# EAGLE design SparkFun_VR_IMU_Breakout_BNO086_QWIIC (EAGLE 9.6.2)
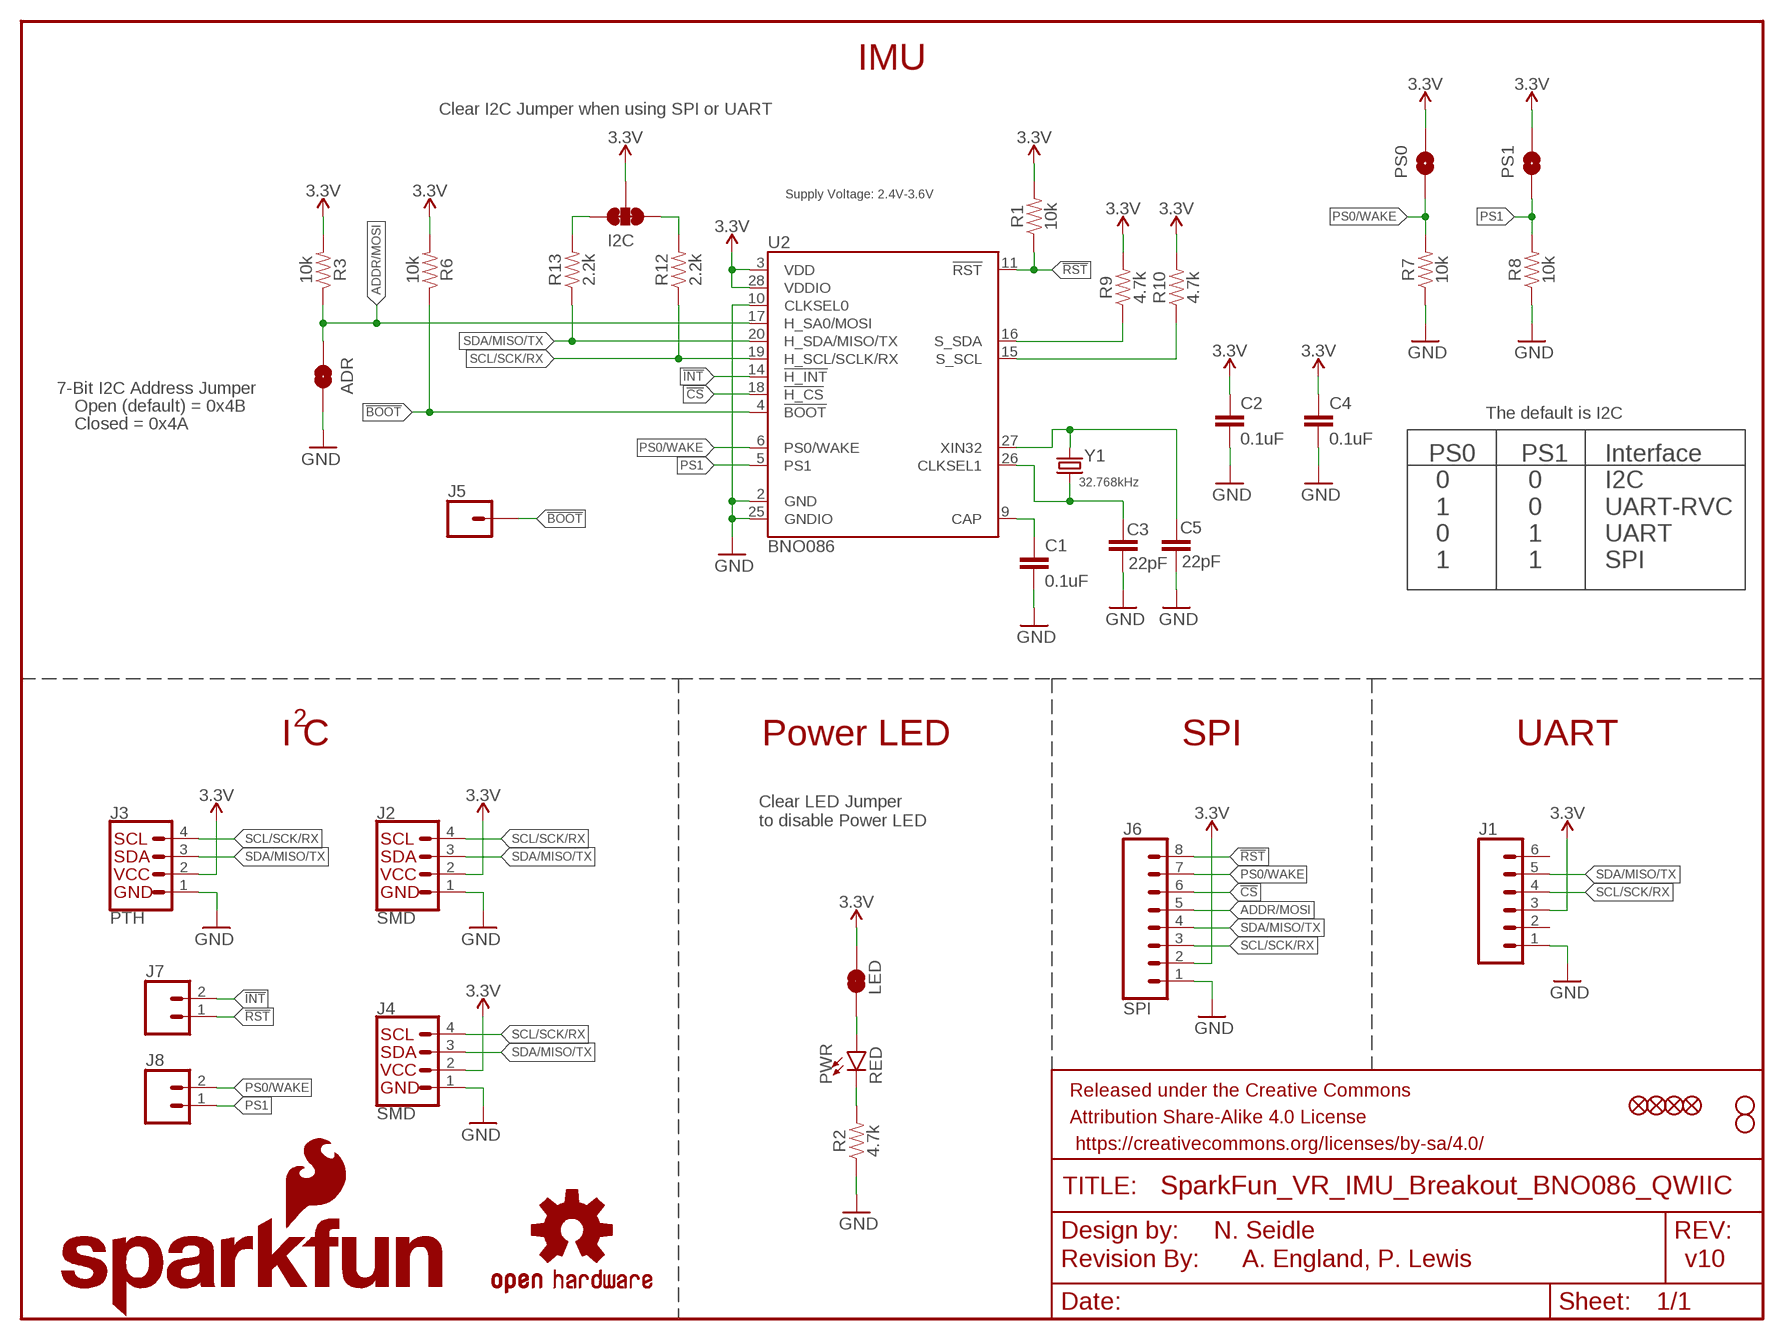
[diagram p0: schematic, sheet 1]

## Parts
ADR  JUMPER-SMT_2_NO_SILK  [SMT-JUMPER_2_NO_SILK]
C1  0.1uF  0.1UF-0603-25V-(+80/-20%)  [0603]
C2  0.1uF  0.1UF-0603-25V-(+80/-20%)  [0603]
C3  22pF  22PF-0603-50V-5%  [0603]
C4  0.1uF  0.1UF-0603-25V-(+80/-20%)  [0603]
C5  22pF  22PF-0603-50V-5%  [0603]
FRAME1  FRAME-LETTER  [CREATIVE_COMMONS]
I2C  JUMPER-SMT_3_2-NC_TRACE_SILK  [SMT-JUMPER_3_2-NC_TRACE_SILK]
J1  CONN_06NO_SILK_FEMALE_PTH  [1X06_NO_SILK]
J2  SMD  QWIIC_CONNECTORJS-1MM  [JST04_1MM_RA]
J3  PTH  I2C_STANDARD_NO_SILK  [1X04_NO_SILK]
J4  SMD  QWIIC_CONNECTORJS-1MM  [JST04_1MM_RA]
J5  CONN_01PTH_NO_SILK_YES_STOP  [1X01_NO_SILK]
J6  SPI  CONN_08NO_SILK_FEMALE_PTH  [1X08_NO_SILK]
J7  CONN_021X02_NO_SILK  [1X02_NO_SILK]
J8  CONN_021X02_NO_SILK  [1X02_NO_SILK]
JP1  FIDUCIALUFIDUCIAL  [FIDUCIAL-MICRO]
JP2  FIDUCIALUFIDUCIAL  [FIDUCIAL-MICRO]
JP3  STAND-OFF  [STAND-OFF]
JP4  STAND-OFF  [STAND-OFF]
JP5  FIDUCIALUFIDUCIAL  [FIDUCIAL-MICRO]
JP6  FIDUCIALUFIDUCIAL  [FIDUCIAL-MICRO]
LED  JUMPER-SMT_2_NC_TRACE_SILK  [SMT-JUMPER_2_NC_TRACE_SILK]
LOGO1  OSHW-LOGOMINI  [OSHW-LOGO-MINI]
LOGO2  REVISION  [REVISION]
LOGO4  SFE_LOGO_FLAME.2_INCH  [SFE_LOGO_FLAME_.2]
LOGO5  SFE_LOGO_NAME_FLAME.1_INCH  [SFE_LOGO_NAME_FLAME_.1]
PS0  JUMPER-SMT_2_NO_SILK  [SMT-JUMPER_2_NO_SILK]
PS1  JUMPER-SMT_2_NO_SILK  [SMT-JUMPER_2_NO_SILK]
PWR  RED  LED-RED_0603-KB  [LED-0603]
R1  10k  10KOHM-0603-1/10W-1%  [0603]
R2  4.7k  4.7KOHM-0603-1/10W-1%  [0603]
R3  10k  10KOHM-0603-1/10W-1%  [0603]
R6  10k  10KOHM-0603-1/10W-1%  [0603]
R7  10k  10KOHM-0603-1/10W-1%  [0603]
R8  10k  10KOHM-0603-1/10W-1%  [0603]
R9  4.7k  4.7KOHM-0603-1/10W-1%  [0603]
R10  4.7k  4.7KOHM-0603-1/10W-1%  [0603]
R12  2.2k  2.2KOHM-0603-1/10W-1%  [0603]
R13  2.2k  2.2KOHM-0603-1/10W-1%  [0603]
U2  BNO086  [LGA-28]
Y1  32.768kHz  CRYSTAL-32.768KHZSMD-3.2X1.5  [CRYSTAL-SMD-3.2X1.5MM]

## Nets
3.3V: C2.1 C4.1 I2C.2 J1.3 J2.2 J3.2 J4.2 J6.2 LED.1 PS0.1 PS1.1 R1.2 R3.2 R6.2 R9.2 R10.2 U2.3(VDD) U2.28(VDDIO)
!BOOT: J5.1 R6.1 U2.4(!BOOT)
!CS: J6.6 U2.18(!H_CS)
!INT: J7.2 U2.14(!H_INT)
!RST: J6.8 J7.1 R1.1 U2.11(!RST)
ADDR/MOSI: ADR.2 J6.5 R3.1 U2.17(H_SA0/MOSI)
CAP: C1.1 U2.9(CAP)
GND: ADR.1 C1.2 C2.2 C3.2 C4.2 C5.2 J1.1 J2.1 J3.1 J4.1 J6.1 R2.1 R7.1 R8.1 U2.2(GND) U2.10(CLKSEL0) U2.25(GNDIO)
N$1: C5.1 U2.27(XIN32) Y1.P$2
N$2: C3.1 U2.26(CLKSEL1) Y1.P$1
N$3: PWR.C R2.2
N$4: LED.2 PWR.A
PS0/WAKE: J6.7 J8.2 PS0.2 R7.2 U2.6(PS0/WAKE)
PS1: J8.1 PS1.2 R8.2 U2.5(PS1)
S_SCL: R10.1 U2.15(S_SCL)
S_SDA: R9.1 U2.16(S_SDA)
SCL/SCK/RX: J1.4 J2.4 J3.4 J4.4 J6.3 R12.1 U2.19(H_SCL/SCLK/RX)
SCL_PU: I2C.1 R12.2
SDA/MISO/TX: J1.5 J2.3 J3.3 J4.3 J6.4 R13.1 U2.20(H_SDA/MISO/TX)
SDA_PU: I2C.3 R13.2
Unconnected: J1.2 J1.6

## Notes on the sheet
- IMU
- Clear I2C Jumper when using SPI or UART
- Supply Voltage: 2.4V-3.6V
- 7-Bit I2C Address Jumper
- Open (default) = 0x4B
- The default is I2C
- Closed = 0x4A
- PS0
   0
   1
   0
   1
- PS1
   0
   0
   1
   1
- Interface
  I2C
  UART-RVC
  UART
  SPI
- 2
- I C | Power LED | SPI | UART
- Clear LED Jumper 
  to disable Power LED
- N. Seidle
- A. England, P. Lewis | v10

## Library data of the parts
ADR PS0 PS1 = SparkFun-Jumpers:JUMPER-SMT_2_NO: Normally open jumper This jumper has two pads in close proximity to each other. Apply solder to close the connection. Round pads are easier to solder for beginners, but are a lot larger. SparkFun Product that uses the round pads: SparkFun EL Sequencer <https://www.sparkfun.com/products/12781>
C1 C2 C4 = SparkFun-Capacitors:0.1UF: 0.1µF ceramic capacitors A capacitor is a passive two-terminal electrical component used to store electrical energy temporarily in an electric field.; PROD_ID: CAP-00810
C3 C5 = SparkFun-Capacitors:22PF: 22pF ceramic capacitors A capacitor is a passive two-terminal electrical component used to store electrical energy temporarily in an electric field.; PROD_ID: CAP-07876
FRAME1 = SparkFun-Aesthetics:FRAME-LETTER: Schematic Frame - Letter Standard 8.5x11 US Letter frame
I2C = SparkFun-Jumpers:JUMPER-SMT_3_2-NC_TRACE: Normally closed trace jumper (2 of 2 connections) This jumper has a trace between all three pads so they are normally closed (NC). Use a razor knife to open the connection(s). For best results follow the IPC guidelines for cutting traces: Cutout at least 0.063 mm (0.005 in). Remove all loose material to clean up the cut area. Seal the cut with an approved epoxy. Reapply solder to reclose the connection(s).
J1 = SparkFun-Connectors:CONN_06: Multi connection point. Often used as Generic Header-pin footprint for 0.1 inch spaced/style header connections On any of the 0.1 inch spaced packages, you can populate with these: Break Away Headers - Straight <https://www.sparkfun.com/products/116> (PRT-00116) Break Away Male Headers - Right Angle <https://www.sparkfun.com/products/553> (PRT-00553) Female Headers <https://www.sparkfun.com/products/115> (PRT-00115) Break Away Headers - Machine Pin <https://www.sparkfun.com/products/117> (PRT-00117) Break Away Female Headers - Swiss Machine Pin <https://www.sparkfun.com/products/743> (PRT-00743) Arduino Stackable Header - 6 Pin <https://www.sparkfun.com/products/9280> (PRT-09280) Screw Terminals 2.54mm Pitch (6-Pin) <https://www.sparkfun.com/products/16499> (PRT-16499) For SCREWTERMINALS and SPRING TERMINALS visit here: Screw Terimnals on SparkFun.com <https://www.sparkfun.com/search/results?term=Screw+Terminals> (5mm/3.5mm/2.54mm spacing) This device is also useful as a general connection point to wire up your design to another part of your project. Our various solder wires solder well into these plated through hole pads. Hook-Up Wire - Assortment (Stranded, 22 AWG) <https://www.sparkfun.com/products/11375> (PRT-11375) Hook-Up Wire - Assortment (Solid Core, 22 AWG) <https://www.sparkfun.com/products/11367> (PRT-11367) View the entire wire category on our website here <https://www.sparkfun.com/categories/141>; PROD_ID: CONN-08437
J2 J4 = SparkFun-Connectors:QWIIC_CONNECTOR: SparkFun I2C Standard Qwiic Connector An SMD 1mm pitch JST connector makes it easy and quick (get it? Qwiic?) to connect I2C devices to each other. The Qwiic system <http://www.sparkfun.com/qwiic> enables fast and solderless connection between popular platforms and various sensors and actuators. We carry 200mm <https://www.sparkfun.com/products/14204>, 100mm <https://www.sparkfun.com/products/14205>, 50mm <https://www.sparkfun.com/products/14206>, and breadboard friendly <https://www.sparkfun.com/products/14207> Qwiic cables. We also offer 10 pcs strips <https://www.sparkfun.com/products/14323> the SMD connectors.; PROD_ID: CONN-13694; VALUE: QWIIC_RIGHT_ANGLE
J3 = SparkFun-Connectors:I2C_STANDARD: SparkFun I2C Standard Pinout Header SparkFun has standardized on a pinout for all I2C based sensor breakouts. This pinout allows I2C boards to be plugged directly into the headers on Arduino Uno compatible boards, and to be daisy chained easily. Example SparkFun Products: SparkFun Atmospheric Sensor Breakout - BME280 <https://www.sparkfun.com/products/13676> SparkFun Altitude/Pressure Sensor Breakout - MPL3115A2 <https://www.sparkfun.com/products/11084> SparkFun TOF Range Finder Sensor - VL6180 <https://www.sparkfun.com/products/12785>
J5 = SparkFun-Connectors:CONN_01: Single connection point. Often used as Generic Header-pin footprint for 0.1 inch spaced/style header connections On any of the 0.1 inch spaced packages, you can populate with these: Break Away Headers - Straight <https://www.sparkfun.com/products/116> (PRT-00116) Break Away Male Headers - Right Angle <https://www.sparkfun.com/products/553> (PRT-00553) Female Headers <https://www.sparkfun.com/products/115> (PRT-00115) Break Away Headers - Machine Pin <https://www.sparkfun.com/products/117> (PRT-00117) Break Away Female Headers - Swiss Machine Pin <https://www.sparkfun.com/products/743> (PRT-00743) This device is also useful as a general connection point to wire up your design to another part of your project. Our various solder wires solder well into these plated through hole pads. Hook-Up Wire - Assortment (Stranded, 22 AWG) <https://www.sparkfun.com/products/11375> (PRT-11375) Hook-Up Wire - Assortment (Solid Core, 22 AWG) <https://www.sparkfun.com/products/11367> (PRT-11367) View the entire wire category on our website here <https://www.sparkfun.com/categories/141> Special notes: SMTSO-256-ET is a "flush mount" nut for a 4-40 screw. We mostly use this on specialty testbeds; it is a nice way to connect hardware to your PCB at an adjustable hieght. Also note, the SNAP packages are for using a snappable style connector. We sell a baggie of snaps and they are also used on two LilyPad designs: Snap Assortment - 30 pack (male and female) <https://www.sparkfun.com/products/11347> (DEV-11347) LilyPad Arduino SimpleSnap <https://www.sparkfun.com/products/10941> (DEV-10941) LilyPad SimpleSnap Protoboard <https://www.sparkfun.com/products/10940> (DEV-10940)
J6 = SparkFun-Connectors:CONN_08: Multi connection point. Often used as Generic Header-pin footprint for 0.1 inch spaced/style header connections On any of the 0.1 inch spaced packages, you can populate with these: Break Away Headers - Straight <https://www.sparkfun.com/products/116> (PRT-00116) Break Away Male Headers - Right Angle <https://www.sparkfun.com/products/553> (PRT-00553) Female Headers <https://www.sparkfun.com/products/115> (PRT-00115) Break Away Headers - Machine Pin <https://www.sparkfun.com/products/117> (PRT-00117) Break Away Female Headers - Swiss Machine Pin <https://www.sparkfun.com/products/743> (PRT-00743) Arduino Stackable Header - 8 Pin <https://www.sparkfun.com/products/9279> (PRT-09279) For SCREWTERMINALS and SPRING TERMINALS visit here: Screw Terimnals on SparkFun.com <https://www.sparkfun.com/search/results?term=Screw+Terminals> (5mm/3.5mm/2.54mm spacing) This device is also useful as a general connection point to wire up your design to another part of your project. Our various solder wires solder well into these plated through hole pads. Hook-Up Wire - Assortment (Stranded, 22 AWG) <https://www.sparkfun.com/products/11375> (PRT-11375) Hook-Up Wire - Assortment (Solid Core, 22 AWG) <https://www.sparkfun.com/products/11367> (PRT-11367) View the entire wire category on our website here <https://www.sparkfun.com/categories/141> Special notes: Molex polarized connector foot print use with SKU : PRT-08231 with associated crimp pins and housings. 1MM SMD Version SKU: PRT-10208 NOTES ON THE VARIANTS LOCK and LOCK_LONGPADS... This footprint was designed to help hold the alignment of a through-hole component (i.e. 6-pin header) while soldering it into place. You may notice that each hole has been shifted either up or down by 0.005 of an inch from it's more standard position (which is a perfectly straight line). This slight alteration caused the pins (the squares in the middle) to touch the edges of the holes. Because they are alternating, it causes a "brace" to hold the component in place. 0.005 has proven to be the perfect amount of "off-center" position when using our standard breakaway headers. Although looks a little odd when you look at the bare footprint, once you have a header in there, the alteration is very hard to notice. Also,if you push a header all the way into place, it is covered up entirely on the bottom side.; PROD_ID: CONN-08438
J7 J8 = SparkFun-Connectors:CONN_02: Multi connection point. Often used as Generic Header-pin footprint for 0.1 inch spaced/style header connections On any of the 0.1 inch spaced packages, you can populate with these: Break Away Headers - Straight <https://www.sparkfun.com/products/116> (PRT-00116) Break Away Male Headers - Right Angle <https://www.sparkfun.com/products/553> (PRT-00553) Female Headers <https://www.sparkfun.com/products/115> (PRT-00115) Break Away Headers - Machine Pin <https://www.sparkfun.com/products/117> (PRT-00117) Break Away Female Headers - Swiss Machine Pin <https://www.sparkfun.com/products/743> (PRT-00743) For SCREWTERMINALS and SPRING TERMINALS visit here: Screw Terimnals on SparkFun.com <https://www.sparkfun.com/search/results?term=Screw+Terminals> (5mm/3.5mm/2.54mm spacing) This device is also useful as a general connection point to wire up your design to another part of your project. Our various solder wires solder well into these plated through hole pads. Hook-Up Wire - Assortment (Stranded, 22 AWG) <https://www.sparkfun.com/products/11375> (PRT-11375) Hook-Up Wire - Assortment (Solid Core, 22 AWG) <https://www.sparkfun.com/products/11367> (PRT-11367) View the entire wire category on our website here <https://www.sparkfun.com/categories/141> Special notes: Molex polarized connector foot print use with: PRT-08233 with associated crimp pins and housings. 2.54_SCREWTERM for use with PRT-10571. 3.5mm Screw Terminal footprints for PRT-08084 5mm Screw Terminal footprints for use with PRT-08432
JP1 JP2 JP5 JP6 = SparkFun-Aesthetics:FIDUCIAL: Fiducial Alignment Points Point-of-reference for pick-and-place machines and other optical instruments.
JP3 JP4 = SparkFun-Hardware:STAND-OFF: Stand Off Drill holes for mechanically mounting via screws, standoffs, etc. Note: Use the keepout ring to avoid running the screw head into surrounding components. Variant Overviews STAND-OFF - Mechanical footprint for a #4 phillips button head screw. STAND-OFF-TIGHT - Mechanical footprint for a #4 phillips button head screw, Example SparkFun Products Screw - Phillips Head (1/4", 4-40, 10 pack) <https://www.sparkfun.com/products/10453> (PRT-10453) Screw - Phillips Head (1/2", 4-40, 10 pack) <https://www.sparkfun.com/products/10452> (PRT-10452) Screw - Phillips Head (3/4", 4-40, 10 pack) <https://www.sparkfun.com/products/10451> (PRT-10451) Screw - Phillips Head (1", 4-40, 10 pack) <https://www.sparkfun.com/products/10450> (PRT-10450)
LED = SparkFun-Jumpers:JUMPER-SMT_2_NC_TRACE: Normally closed trace jumper This jumper has a trace between two pads so it's normally closed (NC). Use a razor knife to open the connection. For best results follow the IPC guidelines for cutting traces: Cutout at least 0.063 mm (0.005 in). Remove all loose material to clean up the cut area. Seal the cut with an approved epoxy. Reapply solder to reclose the connection.
LOGO1 = SparkFun-Aesthetics:OSHW-LOGO: Open-Source Hardware (OSHW) Logo This logo indicates the piece of hardware it is found on incorporates a OSHW license and/or adheres to the definition of open source hardware found here: http://freedomdefined.org/OSHW
LOGO2 = SparkFun-Aesthetics:REVISION: "Revision By" Text Preceding text for revisor documentation. Includes schematic text on "symbols" layer, and board text on tDoc.
LOGO4 = SparkFun-Aesthetics:SFE_LOGO_FLAME: SparkFun Flame Logo This is the SparkFun flame logo. The logo on the schematic will always be the same size; the package variant is the height of the flame. Default layer for the logo on the board is tSilk.
LOGO5 = SparkFun-Aesthetics:SFE_LOGO_NAME_FLAME: SparkFun Font Logo w/ Flame This is the SparkFun full logo. The logo on the schematic will always be the same size; the package variant is the height of the flame part of the logo. Default layer for the logo on the board is tSilk.
PWR = SparkFun-LED:LED-RED: Red SMD LED Used in manufacturing of most products at SparkFun Packages: 0603 - KB - KingBright (DIO-17976) SMD 0603 package [Datasheet] <https://www.kingbrightusa.com/images/catalog/SPEC/APT1608SURCK.pdf> 0603 - (DIO-00819, has gone EOL) SMD 0603 package 0603 SMART - SMD 0603 SMART package ( more efficient and expensive)[Product Link] <http://www.osram-os.com/Graphics/XPic2/00077099_0.pdf> 1206 - SMD1206 package [Product Link] <https://www.sparkfun.com/datasheets/DevTools/LilyPad/Q150OVS4.pdff> SparkFun Products: Pro Mini 328 -5V <https://www.sparkfun.com/products/821> RedBoard <https://www.sparkfun.com/products/12757> IOIO-OTG <https://www.sparkfun.com/products/13613>; PROD_ID: DIO-17976
R1 R3 R6-R8 = SparkFun-Resistors:10KOHM: 10kΩ resistor A resistor is a passive two-terminal electrical component that implements electrical resistance as a circuit element. Resistors act to reduce current flow, and, at the same time, act to lower voltage levels within circuits. - Wikipedia; PROD_ID: RES-00824
R2 R9 R10 = SparkFun-Resistors:4.7KOHM: 4.7kΩ resistor A resistor is a passive two-terminal electrical component that implements electrical resistance as a circuit element. Resistors act to reduce current flow, and, at the same time, act to lower voltage levels within circuits. - Wikipedia; PROD_ID: RES-07857
R12 R13 = SparkFun-Resistors:2.2KOHM: 2.2kΩ resistor A resistor is a passive two-terminal electrical component that implements electrical resistance as a circuit element. Resistors act to reduce current flow, and, at the same time, act to lower voltage levels within circuits. - Wikipedia; PROD_ID: RES-08272
U2 = bno086:BNO086: Hillcrest Labs BNO086 - High Precision IMU (VR) The VR IMU uses the impressive BNO086 IMU. This IC has a combination triple axis accelerometer/gyro/magnetometer packaged with an ARM Cortex M0+ running powerful algorithms. The BNO080 Inertial Measurement Unit (IMU) produces accurate rotation vector headings, excellently suited for VR and other heading applications with a static rotation error of 2 degrees or less. It’s what we’ve been waiting for: all the sensor data is combined and drift corrected into meaningful, accurate IMU information. SparkFun Products: VR IMU (BNO086) <https://www.sparkfun.com/products/22856>; PROD_ID: IC-19164
Y1 = SparkFun-Clocks:CRYSTAL-32.768KHZ: 32.768kHz Crystal Frequency: 32.768kHz Frequency Stability: ±20ppm Load Capacitance: 12.5pF (PTH-2X6 & SMD-3.2X1.5), 6pF (SMD-2X6) SparkFun Products: SparkFun BigTime Watch Kit <https://www.sparkfun.com/products/11734> SparkFun nRF52832 Breakout <https://www.sparkfun.com/products/13990> SparkFun Real Time Clock Module <https://www.sparkfun.com/products/12708>; PROD_ID: XTAL-13062

## Board
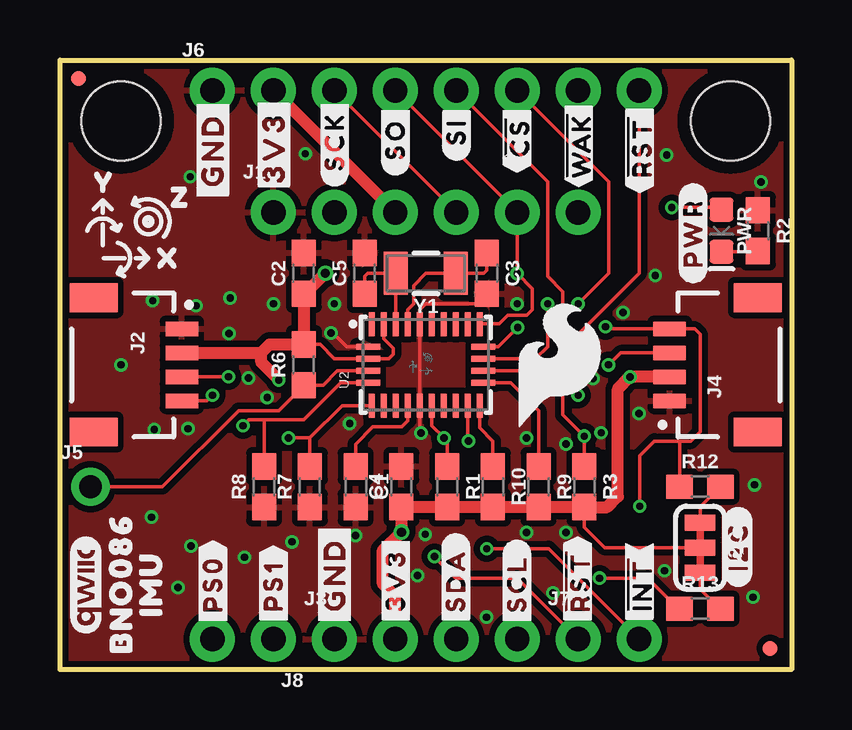
[diagram p1: board, top side]
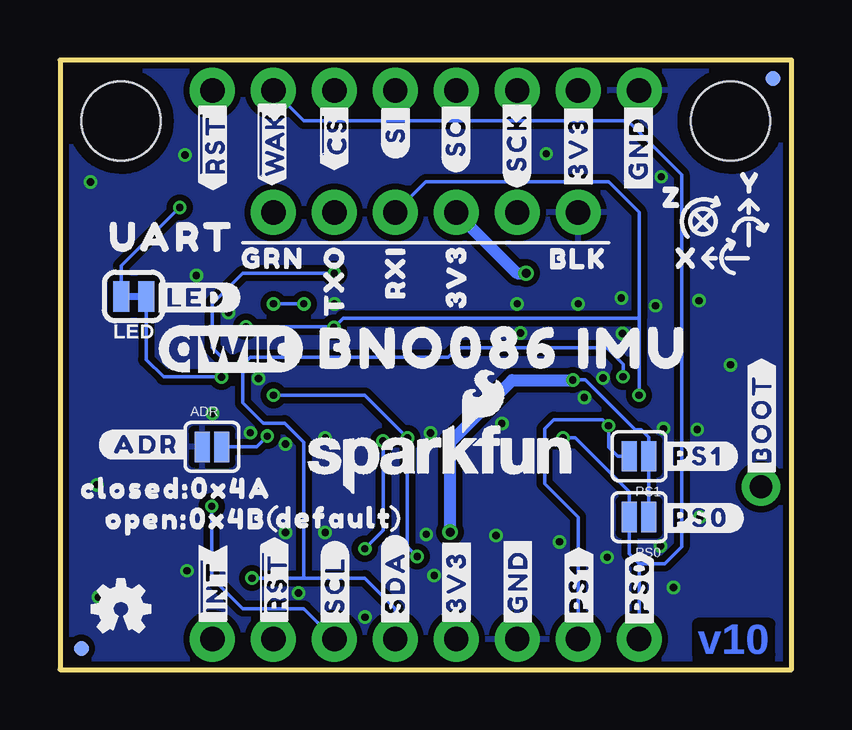
[diagram p2: board, bottom side, seen from below]

Size 30.48 x 25.4 mm. Coordinates in mm from the lower left corner, seen from the top.
Outline: 0,0 0,25.4 30.48,25.4 30.48,0 0,0
Copper layers (1*16): Top 0.035mm / dielectric 1.5mm / Bottom 0.035mm
Design rules "SparkFun-2-Layer-Minimum-JLCPCB": minimum track width 5mil, minimum drill 0.3mm, track to track 5mil, track to pad 5mil, pad to pad 5mil, via to via 5mil, smd to smd 5mil, copper to edge 7mil, drill to drill 7mil, minimum pad ring 5mil, minimum via ring 5mil, stop-mask expansion 2.5mil, vias tented up to drill 25mil, thermal gap 10mil

### Footprints (pad centres in the part's own frame; a part is rotated, then mirrored left to right if it is on the bottom)
SMT-JUMPER_2_NO_SILK = smd 0.635 x 1.27: 1 -0.406,0; 2 0.406,0
0603 = smd 1.1 x 1: 1 -0.85,0; 2 0.85,0
SMT-JUMPER_3_2-NC_TRACE_SILK = smd 0.66 x 1.27: 1 -1.041,0; 2 0,0; 3 1.041,0
1X06_NO_SILK = drill 1.016 pad 1.88: 1 0,0; 2 2.54,0; 3 5.08,0; 4 7.62,0; 5 10.16,0; 6 12.7,0
JST04_1MM_RA = smd 0.6 x 1.35: 1 -1.5,0; 2 -0.5,0; 3 0.5,0; 4 1.5,0 | smd 1.2 x 2: NC1 2.8,-3.675; NC2 -2.8,-3.675
1X04_NO_SILK = drill 1.016 pad 1.88: 1 0,0; 2 2.54,0; 3 5.08,0; 4 7.62,0
1X01_NO_SILK = drill 0.95 pad 1.6: 1 0,0
1X08_NO_SILK = drill 1.016 pad 1.88: 1 0,0; 2 2.54,0; 3 5.08,0; 4 7.62,0; 5 10.16,0; 6 12.7,0; 7 15.24,0; 8 17.78,0
1X02_NO_SILK = drill 1.016 pad 1.88: 1 0,0; 2 2.54,0
FIDUCIAL-MICRO = smd 0.635 x 0.635: 1 0,0
STAND-OFF = hole 3.302: 0,0
SMT-JUMPER_2_NC_TRACE_SILK = smd 0.66 x 1.27: 1 -0.521,0; 2 0.521,0
LED-0603 = smd 1 x 1: A -0.877,0; C 0.877,0
LGA-28 = smd 1 x 0.25: 1 1.7,2.25; 6 -1.7,2.25; 7 -1.7,1.75; 8 -1.7,1.25; 9 -1.7,0.75; 10 -1.7,0.25; 11 -1.7,-0.25; 12 -1.7,-0.75; 13 -1.7,-1.25; 14 -1.7,-1.75; 15 -1.7,-2.25; 20 1.7,-2.25; 21 1.7,-1.75; 22 1.7,-1.25; 23 1.7,-0.75; 24 1.7,-0.25; 25 1.7,0.25; 26 1.7,0.75; 27 1.7,1.25; 28 1.7,1.75 | smd 0.25 x 1: 2 0.75,2.4; 3 0.25,2.4; 4 -0.25,2.4; 5 -0.75,2.4; 16 -0.75,-2.4; 17 -0.25,-2.4; 18 0.25,-2.4; 19 0.75,-2.4
CRYSTAL-SMD-3.2X1.5MM = smd 1 x 1.8: P$1 -1.25,0; P$2 1.25,0

### Placement (x,y rotation side)
ADR  24.15,9.28 0 bottom
C1  12.32,7.62 270 top
C2  10.16,16.51 90 top
C3  17.78,16.51 270 top
C4  14.22,7.62 90 top
C5  12.7,16.51 90 top
FRAME1  -12.7,-7.62 0 top  (outside the outline)
I2C  26.67,5.08 270 top
J1  8.89,19.05 0 top
J2  5.08,12.7 270 top
J3  11.43,1.27 0 top
J4  25.4,12.7 90 top
J5  1.27,7.62 0 top
J6  6.35,24.13 0 top
J7  21.59,1.27 0 top
J8  8.89,1.27 180 top
JP1  29.59,0.89 0 bottom
JP2  29.59,0.89 0 top
JP3  2.54,22.86 0 top
JP4  27.94,22.86 0 top
JP5  0.76,24.64 0 bottom
JP6  0.76,24.64 0 top
LED  27.41,15.54 180 bottom
LOGO1  27.94,2.54 0 bottom
LOGO2  -1.27,-10.16 0 top  (outside the outline)
LOGO4  20.82,12.65 0 top
LOGO5  14.58,8.78 0 bottom
PS0  6.35,6.35 180 bottom
PS1  6.35,8.89 180 bottom
PWR  27.56,18.29 270 top
R1  16.13,7.62 270 top
R2  29.08,18.29 270 top
R3  21.84,7.62 270 top
R6  10.16,12.7 90 top
R7  10.41,7.62 90 top
R8  8.51,7.62 90 top
R9  19.94,7.62 270 top
R10  18.03,7.62 270 top
R12  26.67,7.62 0 top
R13  26.67,2.54 0 top
U2  15.24,12.7 90 top
U$1  [#I2C#874]  28.26,5.11 90 top
U$2  [BLK889]  8.9,17.11 0 bottom
U$3  [X878]  4.51,17.13 0 top
U$4  [##INT##6]  24.1,3.45 90 bottom
U$5  [##RST##5]  21.55,3.61 90 bottom
U$6  [Y879]  1.86,20.3 0 top
U$7  [Z880]  5.02,19.68 0 top
U$8  [#SCL#4]  19.02,3.52 90 bottom
U$9  [#GND#2]  11.4,3.66 90 bottom
U$10  [Y879]  1.7,20.27 0 bottom
U$11  [#SCK#882]  11.44,21.97 90 bottom
U$12  [#SO#867]  13.98,22.1 90 top
U$13  [#SI#868]  16.52,22.4 90 top
U$14  [#SDA#3]  16.51,3.64 90 bottom
U$15  [Z880]  4.97,19.67 0 bottom
U$16  [#GND#2]  6.37,21.73 90 bottom
U$17  [##CS##870]  19.05,22.16 90 top
U$18  [##CS##885]  19.05,22.25 90 bottom
U$19  [##RST##872]  24.14,21.76 90 top
U$20  [##RST##887]  24.12,21.88 90 bottom
U$21  [RXI891]  16.5,16.54 90 bottom
U$22  [TXO892]  19.05,16.22 90 bottom
U$23  [#PS0#874]  6.37,3.56 90 top
U$24  [BNO0861]  2.55,3.59 90 top
U$25  [X878]  4.36,17.13 0 bottom
U$26  [#LED#0]  24.81,15.5 0 bottom
U$27  [#3V3#874]  13.96,3.64 90 bottom
U$28  [OPEN#0X4B0]  25.24,6.28 0 bottom
U$29  [QWIIC_4MM]  1.09,3.53 90 top
U$30  [#ADR#894]  26.89,9.38 0 bottom
U$31  [IMU862]  3.78,3.57 90 top
U$32  [#GND#864]  6.37,21.64 90 top
U$33  [#PS1#1]  8.86,3.39 90 bottom
U$34  [#PS0#2]  6.33,3.47 90 bottom
U$35  [#PS1#895]  3.92,8.89 0 bottom
U$36  [#3V3#865]  8.92,21.73 90 top
U$37  [#SCK#866]  11.45,21.99 90 top
U$38  [##WAK##871]  21.61,22.01 90 top
U$39  [#3V3#882]  8.88,21.73 90 bottom
U$40  [3V3891]  13.96,16.38 90 bottom
U$41  [GRN890]  21.62,17.13 0 bottom
U$42  [#PWR#873]  26.38,18.18 90 top
U$43  [#PS1#874]  8.89,3.47 90 top
U$44  [UART881]  25.81,18.01 0 bottom
U$45  [#GND#864]  11.44,3.95 90 top
U$46  [#3V3#874]  13.99,3.71 90 top
U$47  [#SDA#874]  16.49,3.72 90 top
U$48  [#SCL#875]  19.04,3.58 90 top
U$49  [#BOOT#888]  1.24,10.45 90 bottom
U$50  [##RST##876]  21.57,3.66 90 top
U$51  [##INT##877]  24.14,3.54 90 top
U$52  [QWIIC_6MM]  23.33,13.35 0 bottom
U$53  [##WAK##886]  21.64,21.83 90 bottom
U$54  [BNO086_IMU881]  12.01,13.39 0 bottom
U$55  [#SO#883]  13.99,22.23 90 bottom
U$56  [#SI#884]  16.49,22.49 90 bottom
U$57  [#PS0#895]  3.79,6.32 0 bottom
U$58  [CLOSED#0X4A0]  25.63,7.54 0 bottom
U$59  [ORDERING_INSTRUCTIONS]  45.72,54.61 0 top  (outside the outline)
U$61  [DEFAULT0]  19.06,6.32 0 bottom
Y1  15.24,16.51 180 top

### Tracks (layer width: path | path; a pad name or v marks a point on that pad's centre or on a via)
3.3V  (via drill 0.3, 0.38)
  Top 0.152: R6.2 10.83,13.55 11.43,12.95 U2.3 13.7,12.95 13.89,13.14 13.89,13.39 13.49,13.79 U2.28 | C2.1 10.2,15.66 | v23.76,12.2 v23.75,12.19 | R3.2 21.84,5.94 22.7,5.08 I2C.2
  Top 0.508: J4.2 v23.76,12.2 | J6.2 J1.3 | C2.1 R6.2 8.74,13.55 8.39,13.2 | v11.06,16.52 10.2,15.66 | v23.75,12.19 23.24,11.68 23.24,7.22 22.79,6.77 R3.2 R9.2 R10.2 R1.2 C4.1 v14.22,5.73 | J2.2 8.39,13.2 | v14.22,5.73 v14.23,5.73 | v14.22,5.73 13.46,4.97 13.46,3.57 13.97,3.06 J3.2 | v9.11,12.07 8.39,12.8 8.39,13.2
  Bottom 0.152: PS0.1 PS1.1 5.94,9.67 6.26,9.99 6.51,9.99 8.59,12.07 v9.11,12.07 | v23.75,12.19 26.16,12.19 26.89,12.92 LED.1
  Bottom 0.508: J1.3 11.45,16.52 v11.06,16.52 | v14.23,5.73 14.23,9.48 11.64,12.06 v9.12,12.06 v9.11,12.07
!BOOT
  Top 0.152: U2.4 11.56,12.45 10.96,11.85 R6.1 10.16,11.83 9.12,10.79 7.45,10.79 4.27,7.62 J5.1
!CS  (via drill 0.3)
  Top 0.152: v21.59,15.24 22.86,16.51 22.86,20.32 J6.6 | U2.18 19.81,12.95 20.32,13.46 v20.32,15.24
  Bottom 0.152: v21.59,15.24 v20.32,15.24
!INT  (via drill 0.3)
  Top 0.152: U2.14 16.99,9.55 v17.02,9.53 | v17.78,5.04 20.36,5.04 J7.2
  Bottom 0.152: v17.02,9.53 17.02,5.8 v17.78,5.04
!RST  (via drill 0.3)
  Top 0.152: U2.11 15.49,10.16 v16,9.65 16.13,9.53 R1.1 | J6.8 24.13,16.51 21.59,13.97 v21.59,11.43 | v15.6,4.71 v15.6,4.7 16.49,3.81 19.05,3.81 J7.1
  Bottom 0.152: v15.6,4.71 16,5.11 v16,9.65 17.78,11.43 v21.59,11.43
ADDR/MOSI  (via drill 0.3)
  Top 0.152: 20.95,12.45 20.95,15.75 20.32,16.38 20.32,20.32 J6.5 | 20.95,12.45 20.95,10.62 v21.84,9.73 R3.1 | U2.17 20.95,12.45
  Bottom 0.152: ADR.2 22.29,9.28 v21.84,9.73
CAP
  Top 0.152: U2.9 14.49,10.36 14.25,10.12 13.04,10.12 12.32,9.4 C1.1
GND  (via drill 0.3)
  Top 0.152: U2.2 11.95,13.45 11.43,13.97 | C3.2 17.36,15.24 15.24,15.24 14.99,14.99 U2.25 U2.10 14.99,9.9 v15.04,9.86
  other vias: 24.13,10.67 14.89,3.92 12.32,5.59 2.54,12.7 28.94,7.7 3.81,6.35 8.89,15.24 19.05,15.24 11.43,15.24 29.21,20.32 22.55,9.87 21.08,9.4 19.43,9.65 21.08,5.71 19.43,5.71 7.09,15.48 5.66,15.16 3.86,15.37 10.22,21.49 25.28,21.44 9.67,5.32 7.68,4.68 4.91,3.43 25.18,4.12 28.87,3.02 15.22,5.64 12.07,10.25 8.63,11.34 23.46,14.88 5.46,5.15 22.2,12.13 7.04,14.01 24.8,16.43 7.85,12.15 5.34,10.04 3.93,10 5.43,20.54 17.77,2.18 20.54,3.2 11.29,14.03
  pour Bottom (isolate 0.254): 0,0 0,25.4 30.48,25.4 30.48,0
  pour Top (isolate 0.254): 0,0 0,25.4 30.48,25.4 30.48,0
N$1
  Top 0.152: U2.27 Y1.P$2 12.83,16.51 12.7,16.38 C5.1
N$2
  Top 0.152: C3.1 17.78,16.64 17.65,16.51 Y1.P$1 15.24,16.51 14.73,16 14.73,15.24 14.49,15 U2.26
N$3
  Top 0.152: PWR.C 29.06,17.41 R2.2
N$4  (via drill 0.3)
  Top 0.152: PWR.A 27.47,19.26 v25.49,19.26
  Bottom 0.152: LED.2 27.93,16.82 v25.49,19.26
PS0/WAKE  (via drill 0.3)
  Top 0.152: U2.6 11.76,11 10.41,9.65 | 10.41,9.65 R7.2 | 10.41,9.65 v9.53,9.65
  Bottom 0.152: v9.53,9.65 9.01,9.65 6.76,7.4 PS0.2 6.76,4.82 6.35,4.41 | J6.7 20.32,22.86 6.82,22.86 4.58,20.62 4.58,5.13 5.29,4.41 6.35,4.41 | 6.35,4.41 J8.2
PS1  (via drill 0.3)
  Top 0.152: U2.5 11.7,11.95 10.16,10.41 8.51,10.41 | 8.51,10.41 7.87,10.41 v7.62,10.16 | R8.2 8.51,10.41
  Bottom 0.152: PS1.2 7.24,8.89 7.62,9.27 v7.62,10.16 7.87,10.41 9.91,10.41 10.29,10.03 10.29,7.75 8.89,6.35 J8.1
S_SCL
  Top 0.152: U2.15 17.49,10.07 18.03,9.53 R10.1
S_SDA
  Top 0.152: U2.16 18.78,11.95 19.94,10.79 R9.1
SCL/SCK/RX  (via drill 0.3)
  Top 0.152: U2.19 18.26,13.45 v19.07,14.26 | v22.73,14.29 22.81,14.2 J4.4 26.44,14.2 26.67,13.97 26.67,9.91 26.29,9.53 25.78,9.53 | J2.4 6.12,11.2 v6.35,11.43 | 25.78,9.53 24.77,9.53 24.16,8.91 v24.16,6.81 | J6.3 J1.4 | R12.1 25.82,9.49 25.78,9.53
  Bottom 0.152: v22.73,14.29 19.1,14.29 v19.07,14.26 18.69,14.64 6.35,14.64 | J3.4 20.32,2.54 22.86,2.54 24.16,3.83 v24.16,6.81 | 6.35,14.64 6.35,19.05 7.62,20.32 15.24,20.32 J1.4 | v6.35,11.43 6.35,14.64
SCL_PU
  Top 0.152: I2C.1 26.67,6.78 R12.2
SDA/MISO/TX  (via drill 0.3)
  Top 0.152: J4.3 23.36,13.2 v22.86,12.7 | J6.4 J1.5 v19.05,16.51 19.68,15.88 19.68,14.99 19.45,14.76 18.66,14.76 18.3,14.4 U2.20 | v22.48,3.81 24.48,3.81 25.75,2.54 R13.1 | J2.3 v7.02,12.2
  Bottom 0.152: v19.05,16.51 22.86,16.51 24.13,15.24 24.13,13.4 23.43,12.7 v22.86,12.7 | J3.3 16.51,2.54 17.78,3.81 20.32,3.81 | v22.48,3.81 20.32,3.81 | v22.86,12.7 22.55,13.01 14.3,13.01 13.91,13.41 7.7,13.41 7.02,12.73 v7.02,12.2 | v22.86,12.7 22.86,11.12 22.01,10.27 21.12,10.27 20.32,9.47 20.32,3.81
SDA_PU
  Top 0.152: I2C.3 26.67,3.34 27.47,2.54 R13.2

### Text on the board
Bottom: v10
Measures: Measure Units: INCHES
tDocu: Soldermask: Red / Thickness: 1.6mm / 2-Layer Design / 1oz copper / Finish: HASL | N. Seidle | A. England, P. Lewis